# EasyEDA schematic SCH_Extension-Platine-Relais-ESP32-Veth_2025-05-01 (1).json
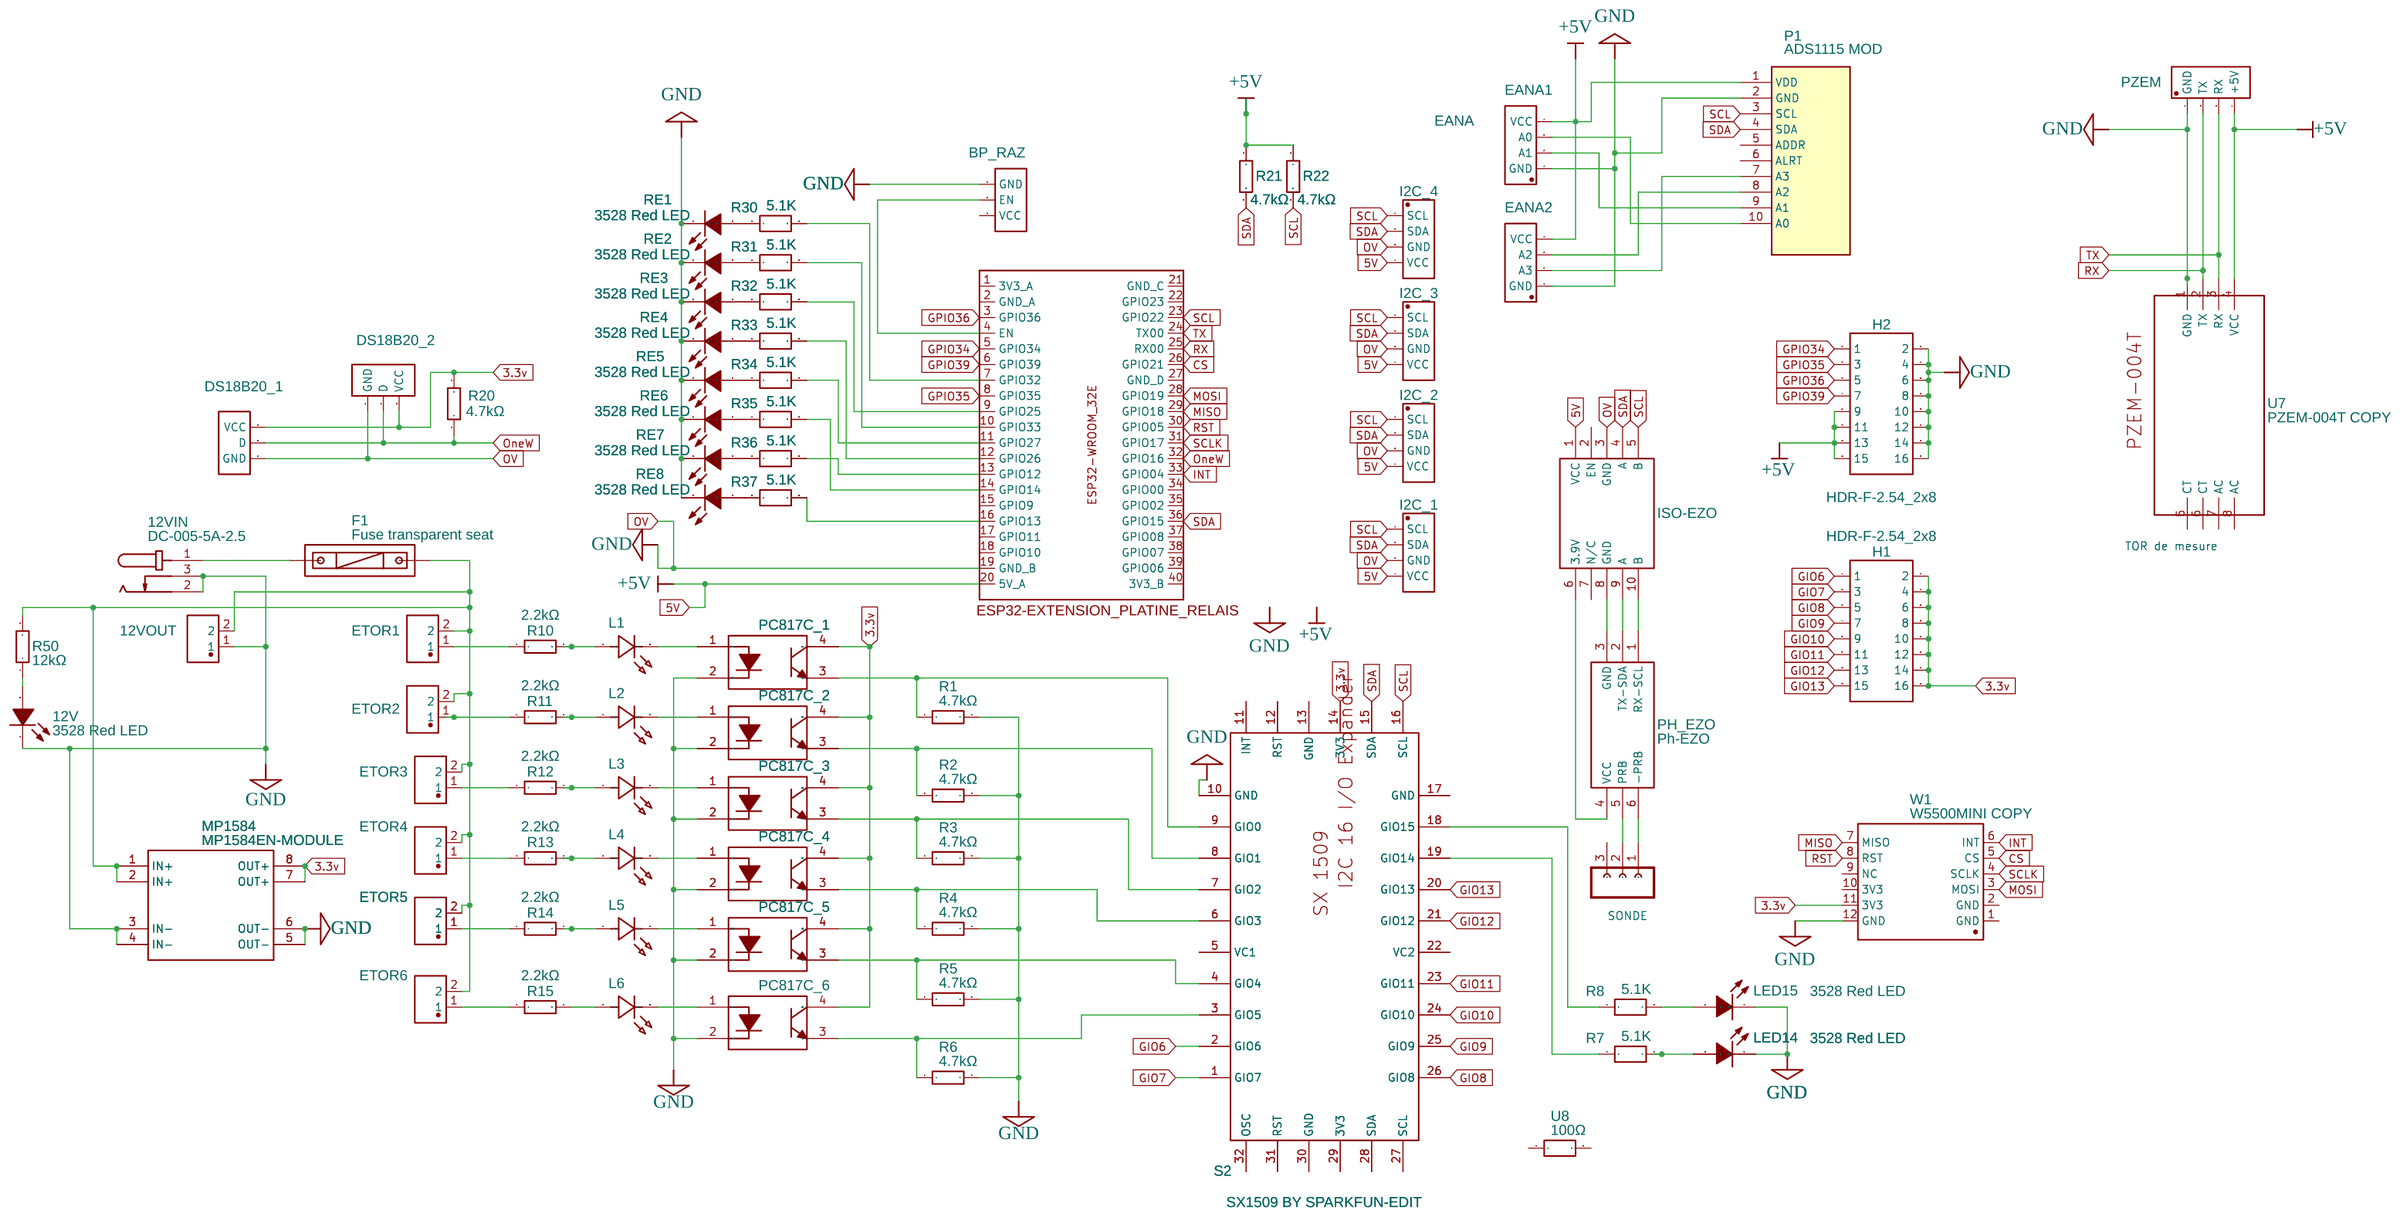
[diagram p0: schematic sheet]

## Parts
12V  3528 Red LED  [LED-SMD_L3.2-W2.8-RD_TJ-S3528UG6W9TLC9Y-A5]
12VIN  DC-005-5A-2.5  [DC-IN-TH_DC-005-5A-2.5]
12VOUT  12V1  [CONN-TH_2P-P5.08_DB128L-5.08-2P]
BP_RAZ  RAZ  [JST-XH-03-PACKAGE-LONG-PAD]
DS18B20_1  DS18B20_1  [JST-XH-03-PACKAGE-LONG-PAD]
DS18B20_2  DS18B20_2  [JST-XH-03-PACKAGE-LONG-PAD]
EANA1  I2C_2  [JST-XH-04-PACKAGE-LONG-PAD]
EANA2  I2C_2  [JST-XH-04-PACKAGE-LONG-PAD]
ETOR1  ETOR1  [CONN-TH_2P-P5.08_DB128L-5.08-2P]
ETOR2  ETOR1  [CONN-TH_2P-P5.08_DB128L-5.08-2P]
ETOR3  ETOR1  [CONN-TH_2P-P5.08_DB128L-5.08-2P]
ETOR4  ETOR1  [CONN-TH_2P-P5.08_DB128L-5.08-2P]
ETOR5  ETOR1  [CONN-TH_2P-P5.08_DB128L-5.08-2P]
ETOR6  ETOR1  [CONN-TH_2P-P5.08_DB128L-5.08-2P]
F1  Fuse transparent seat  [FUSE-TH_L24.5-W9.8-P22.5]
H1  HDR-F-2.54_2x8  [HDR-F-2.54_2X8]
H2  HDR-F-2.54_2x8  [HDR-F-2.54_2X8]
I2C_1  I2C_2  [JST-XH-04-PACKAGE-LONG-PAD]
I2C_2  I2C_2  [JST-XH-04-PACKAGE-LONG-PAD]
I2C_3  I2C_2  [JST-XH-04-PACKAGE-LONG-PAD]
I2C_4  I2C_2  [JST-XH-04-PACKAGE-LONG-PAD]
ISO-EZO  EZO-PH-ISOLATOR  [EZO-PH-ISOLATOR]
L1  HLMP-4700  [LED-TH_BD5.8-P2.54-FD]
L2  HLMP-4700  [LED-TH_BD5.8-P2.54-FD]
L3  HLMP-4700  [LED-TH_BD5.8-P2.54-FD]
L4  HLMP-4700  [LED-TH_BD5.8-P2.54-FD]
L5  HLMP-4700  [LED-TH_BD5.8-P2.54-FD]
L6  HLMP-4700  [LED-TH_BD5.8-P2.54-FD]
LED14  3528 Red LED  [LED-SMD_L3.2-W2.8-RD_TJ-S3528UG6W9TLC9Y-A5]
LED15  3528 Red LED  [LED-SMD_L3.2-W2.8-RD_TJ-S3528UG6W9TLC9Y-A5]
MP1584  MP1584EN-MODULE  [MP1584EN-MODULE]
P1  ADS1115 MOD  [ADS1115MOD]
PH_EZO  Ph-EZO  [EC-EZO]
PZEM  I2C_2  [JST-XH-04-PACKAGE-LONG-PAD]
R1  4.7kΩ  [RES-TH_BD1.9-L3.3-P7.30-D0.5]
R2  4.7kΩ  [RES-TH_BD1.9-L3.3-P7.30-D0.5]
R3  4.7kΩ  [RES-TH_BD1.9-L3.3-P7.30-D0.5]
R4  4.7kΩ  [RES-TH_BD1.9-L3.3-P7.30-D0.5]
R5  4.7kΩ  [RES-TH_BD1.9-L3.3-P7.30-D0.5]
R6  4.7kΩ  [RES-TH_BD1.9-L3.3-P7.30-D0.5]
R7  5.1K  [R1206]
R8  5.1K  [R1206]
R10  2.2kΩ  [RES-TH_BD1.7-L3.5-P7.50-D0.5]
R11  2.2kΩ  [RES-TH_BD1.7-L3.5-P7.50-D0.5]
R12  2.2kΩ  [RES-TH_BD1.7-L3.5-P7.50-D0.5]
R13  2.2kΩ  [RES-TH_BD1.7-L3.5-P7.50-D0.5]
R14  2.2kΩ  [RES-TH_BD1.7-L3.5-P7.50-D0.5]
R15  2.2kΩ  [RES-TH_BD1.7-L3.5-P7.50-D0.5]
R20  4.7kΩ  [RES-TH_BD1.9-L3.3-P7.30-D0.5]
R21  4.7kΩ  [RES-TH_BD1.9-L3.3-P7.30-D0.5]
R22  4.7kΩ  [RES-TH_BD1.9-L3.3-P7.30-D0.5]
R30  5.1K  [R1206]
R31  5.1K  [R1206]
R32  5.1K  [R1206]
R33  5.1K  [R1206]
R34  5.1K  [R1206]
R35  5.1K  [R1206]
R36  5.1K  [R1206]
R37  5.1K  [R1206]
R50  12kΩ  [RES-TH_BD1.7-L3.5-P7.50-D0.5]
RE1  3528 Red LED  [LED-SMD_L3.2-W2.8-RD_TJ-S3528UG6W9TLC9Y-A5]
RE2  3528 Red LED  [LED-SMD_L3.2-W2.8-RD_TJ-S3528UG6W9TLC9Y-A5]
RE3  3528 Red LED  [LED-SMD_L3.2-W2.8-RD_TJ-S3528UG6W9TLC9Y-A5]
RE4  3528 Red LED  [LED-SMD_L3.2-W2.8-RD_TJ-S3528UG6W9TLC9Y-A5]
RE5  3528 Red LED  [LED-SMD_L3.2-W2.8-RD_TJ-S3528UG6W9TLC9Y-A5]
RE6  3528 Red LED  [LED-SMD_L3.2-W2.8-RD_TJ-S3528UG6W9TLC9Y-A5]
RE7  3528 Red LED  [LED-SMD_L3.2-W2.8-RD_TJ-S3528UG6W9TLC9Y-A5]
RE8  3528 Red LED  [LED-SMD_L3.2-W2.8-RD_TJ-S3528UG6W9TLC9Y-A5]
S2  SX1509 BY SPARKFUN-EDIT  [SPARKFUN SX1509-EDIT]
SONDE  FE03-1"  [FE03-1]
U1  PC817C_1  [DIP-4_L6.5-W4.6-P2.54-LS7.6-BL]
U2  PC817C_2  [DIP-4_L6.5-W4.6-P2.54-LS7.6-BL]
U3  PC817C_3  [DIP-4_L6.5-W4.6-P2.54-LS7.6-BL]
U4  PC817C_4  [DIP-4_L6.5-W4.6-P2.54-LS7.6-BL]
U5  PC817C_5  [DIP-4_L6.5-W4.6-P2.54-LS7.6-BL]
U6  PC817C_6  [DIP-4_L6.5-W4.6-P2.54-LS7.6-BL]
U7  PZEM-004T COPY  [PZEM-004T]
U8  100Ω  [R1812]
U$1  ESP32-PLATINE_RELAIS  [ESP32-EXTENSION_PLATINE_RELAIS]
W1  W5500MINI COPY  [W5500]

## Library data of the parts
12V LED14 LED15 RE1-RE8 = 3528 Red LED: Supplier: LCSC; Manufacturer: null; Manufacturer Part: 3528R (SMT业务专用); Supplier Part: C2305; JLCPCB Part Class: Extended Part
12VIN = DC-005-5A-2.5: Contributor: LCSC; Supplier: LCSC; Supplier Part: C381115; Manufacturer: XKB Connectivity(中国星坤); JLCPCB Part Class: Extended Part
12VOUT ETOR1-ETOR6 = DB128L-5.08-2P: Contributor: LCSC; Supplier: LCSC; Supplier Part: C395868; Manufacturer: DORABO(地博电气); Manufacturer Part: DB128L-5.08-2P-GN-S; JLCPCB Part Class: Extended Part
BP_RAZ = -: Supplier: LCSC; Manufacturer: BOOMELE; Manufacturer Part: Header2.54mm 1*3P; image: //image.lceda.cn/szlcsc/C49257.jpg; Supplier Part: C49257
DS18B20_1 DS18B20_2 = -: Supplier: LCSC; Manufacturer: BOOMELE; Manufacturer Part: Header2.54mm 1*3P; image: //image.lceda.cn/szlcsc/C49257.jpg; Supplier Part: C49257; Package Display: No
EANA1 EANA2 I2C_1-I2C_4 PZEM = -: Supplier: LCSC; Manufacturer: Ckmtw; Manufacturer Part: 210S-1*4P L=11.6MMGold-plated black; Contributor: LCSC; Supplier Part: C124378
F1 = Fuse transparent seat: Supplier: LCSC; Manufacturer Part: 保险丝透明座; Manufacturer: xcfuse(旭程); Supplier Part: C58066; JLCPCB Part Class: Extended Part
H1 H2 = HDR-F-2.54_2x8: Supplier Part: C30734; Supplier: LCSC; Contributor: LCEDA_Lib
ISO-EZO = EZO-PH-ISOLATOR: Contributor: Ronak Bera
L1-L6 = HLMP-4700: Contributor: lcsc; Supplier: LCSC; Supplier Part: C2686007; Manufacturer: Broadcom/AVAGO(安华高); JLCPCB Part Class: Extended Part
MP1584 = MP1584EN-MODULE: Contributor: SoulEater
P1 = ADS1115 MOD: sourceId: 1T5FDZYC8
PH_EZO = EC-EZO: Contributor: yns4putra
R1-R6 R20-R22 = MFR0W8F4701A50: Supplier: LCSC; Manufacturer: UNI-ROYAL(厚声); Supplier Part: C58678; JLCPCB Part Class: Extended Part
R7 R8 R30-R37 = R_1206_EU: Contributor: LCEDA_Lib
R10-R15 R50 = MFR0W8F2201A50: Supplier: LCSC; Manufacturer: UNI-ROYAL(厚声); Supplier Part: C58682; JLCPCB Part Class: Extended Part
S2 = SX1509 BY SPARKFUN-EDIT: Manufacturer: SPARkFUN; Manufacturer Part: SX1509; Supplier Part: SX1509; Contributor: NUJAB2S
U1-U6 = PC817C_C5186572: Contributor: lcsc; Supplier: LCSC; Supplier Part: C5186572; Manufacturer: Slkor(萨科微); Manufacturer Part: PC817C; JLCPCB Part Class: Extended Part
U7 = PZEM-004T COPY: Contributor: fernandolopes38
U8 = FRC1812J101 TS: Contributor: lcsc; Supplier: LCSC; Supplier Part: C2933911; Manufacturer: FOJAN(富捷); JLCPCB Part Class: Extended Part
U$1 = -: Package Display: Yes
W1 = W5500MINI: Contributor: acerca_soluciones

## Nets
3.3v: DS18B20_1.3(VCC) DS18B20_2.3(VCC) H1.2 H1.4 H1.6 H1.8 H1.10 H1.12 H1.14 H1.16 MP1584.7(OUT+) MP1584.8(OUT+) R20.1 S2.14(3V3) U1.4(Collector) U2.4(Collector) U3.4(Collector) U4.4(Collector) U5.4(Collector) U6.4(Collector) W1.11(3V3)
+5V: EANA1.4(VCC) EANA2.4(VCC) H2.9 H2.11 H2.13 H2.15 I2C_1.4(VCC) I2C_2.4(VCC) I2C_3.4(VCC) I2C_4.4(VCC) ISO-EZO.1(VCC) P1.1(VDD) PZEM.4(+5V) R21.1 R22.1 U7.4(VCC) U$1.20(5V_A)
GND: 12V.1(K) 12VIN.2 12VIN.3 12VOUT.1 BP_RAZ.1(GND) DS18B20_1.1(GND) DS18B20_2.1(GND) EANA1.1(GND) EANA2.1(GND) H2.2 H2.4 H2.6 H2.8 H2.10 H2.12 H2.14 H2.16 I2C_1.3(GND) I2C_2.3(GND) I2C_3.3(GND) I2C_4.3(GND) ISO-EZO.3(GND) LED14.1(K) LED15.1(K) MP1584.3(IN-) MP1584.4(IN-) MP1584.5(OUT-) MP1584.6(OUT-) P1.2(GND) PZEM.1(GND) R1.2 R2.2 R3.2 R4.2 R5.2 R6.2 RE1.1(K) RE2.1(K) RE3.1(K) RE4.1(K) RE5.1(K) RE6.1(K) RE7.1(K) RE8.1(K) S2.10(GND) U1.2(Cathode) U2.2(Cathode) U3.2(Cathode) U4.2(Cathode) U5.2(Cathode) U6.2(Cathode) U7.1(GND) U$1.19(GND_B) W1.12(GND)
CS: U$1.26(GPIO21) W1.5(CS)
GIO6: H1.1 S2.2(GIO6)
GIO7: H1.3 S2.1(GIO7)
GIO8: H1.5 S2.26(GIO8)
GIO9: H1.7 S2.25(GIO9)
GIO10: H1.9 S2.24(GIO10)
GIO11: H1.11 S2.23(GIO11)
GIO12: H1.13 S2.21(GIO12)
GIO13: H1.15 S2.20(GIO13)
GPIO34: H2.1 U$1.5(GPIO34)
GPIO35: H2.3 U$1.8(GPIO35)
GPIO36: H2.5 U$1.3(GPIO36)
GPIO39: H2.7 U$1.6(GPIO39)
INT: U$1.33(GPIO04) W1.6(INT)
MISO: U$1.29(GPIO18) W1.7(MISO)
MOSI: U$1.28(GPIO19) W1.3(MOSI)
OneW: DS18B20_1.2(D) DS18B20_2.2(D) R20.2 U$1.32(GPIO16)
RST: U$1.30(GPIO05) W1.8(RST)
RX: PZEM.2(TX) U7.2(TX) U$1.25(RX00)
SCL: I2C_1.1(SCL) I2C_2.1(SCL) I2C_3.1(SCL) I2C_4.1(SCL) ISO-EZO.5(B) P1.3(SCL) R22.2 S2.16(SCL) U$1.23(GPIO22)
SCLK: U$1.31(GPIO17) W1.4(SCLK)
SDA: I2C_1.2(SDA) I2C_2.2(SDA) I2C_3.2(SDA) I2C_4.2(SDA) ISO-EZO.4(A) P1.4(SDA) R21.2 S2.15(SDA) U$1.36(GPIO15)
TX: PZEM.3(RX) U7.3(RX) U$1.24(TX00)
Net-(12V-2): 12V.2(A) R50.1
Net-(12VIN-1): 12VIN.1 F1.1
Net-(12VOUT-2): 12VOUT.2 ETOR1.2 ETOR2.2 ETOR3.2 ETOR4.2 ETOR5.2 ETOR6.2 F1.2 MP1584.1(IN+) MP1584.2(IN+) R50.2
Net-(BP_RAZ-2): BP_RAZ.2(EN) U$1.4(EN)
Net-(EANA1-2): EANA1.2(A1) P1.9(A1)
Net-(EANA1-3): EANA1.3(A0) P1.10(A0)
Net-(EANA2-2): EANA2.2(A3) P1.7(A3)
Net-(EANA2-3): EANA2.3(A2) P1.8(A2)
Net-(ETOR1-1): ETOR1.1 R10.1
Net-(ETOR2-1): ETOR2.1 R11.1
Net-(ETOR3-1): ETOR3.1 R12.1
Net-(ETOR4-1): ETOR4.1 R13.1
Net-(ETOR5-1): ETOR5.1 R14.1
Net-(ETOR6-1): ETOR6.1 R15.1
Net-(ISO-EZO-6): ISO-EZO.6(3.9V) PH_EZO.4(VCC)
Net-(ISO-EZO-8): ISO-EZO.8(GND) PH_EZO.3(GND)
Net-(ISO-EZO-9): ISO-EZO.9(A) PH_EZO.2(TX-SDA)
Net-(ISO-EZO-10): ISO-EZO.10(B) PH_EZO.1(RX-SCL)
Net-(L1-1): L1.1(A) R10.2
Net-(L1-2): L1.2(K) U1.1(Anode)
Net-(L2-1): L2.1(A) R11.2
Net-(L2-2): L2.2(K) U2.1(Anode)
Net-(L3-1): L3.1(A) R12.2
Net-(L3-2): L3.2(K) U3.1(Anode)
Net-(L4-1): L4.1(A) R13.2
Net-(L4-2): L4.2(K) U4.1(Anode)
Net-(L5-1): L5.1(A) R14.2
Net-(L5-2): L5.2(K) U5.1(Anode)
Net-(L6-1): L6.1(A) R15.2
Net-(L6-2): L6.2(K) U6.1(Anode)
Net-(LED14-2): LED14.2(A) R7.2
Net-(LED15-2): LED15.2(A) R8.2
Net-(PH_EZO-5): PH_EZO.5(PRB) SONDE.2
Net-(PH_EZO-6): PH_EZO.6(-PRB) SONDE.1
Net-(R1-1): R1.1 S2.9(GIO0) U1.3(Emitter)
Net-(R2-1): R2.1 S2.8(GIO1) U2.3(Emitter)
Net-(R3-1): R3.1 S2.7(GIO2) U3.3(Emitter)
Net-(R4-1): R4.1 S2.6(GIO3) U4.3(Emitter)
Net-(R5-1): R5.1 S2.4(GIO4) U5.3(Emitter)
Net-(R6-1): R6.1 S2.3(GIO5) U6.3(Emitter)
Net-(R7-1): R7.1 S2.19(GIO14)
Net-(R8-1): R8.1 S2.18(GIO15)
Net-(R30-1): R30.1 RE1.2(A)
Net-(R30-2): R30.2 U$1.7(GPIO32)
Net-(R31-1): R31.1 RE2.2(A)
Net-(R31-2): R31.2 U$1.10(GPIO33)
Net-(R32-1): R32.1 RE3.2(A)
Net-(R32-2): R32.2 U$1.9(GPIO25)
Net-(R33-1): R33.1 RE4.2(A)
Net-(R33-2): R33.2 U$1.12(GPIO26)
Net-(R34-1): R34.1 RE5.2(A)
Net-(R34-2): R34.2 U$1.11(GPIO27)
Net-(R35-1): R35.1 RE6.2(A)
Net-(R35-2): R35.2 U$1.14(GPIO14)
Net-(R36-1): R36.1 RE7.2(A)
Net-(R36-2): R36.2 U$1.13(GPIO12)
Net-(R37-1): R37.1 RE8.2(A)
Net-(R37-2): R37.2 U$1.16(GPIO13)

Not connected (* = marked no-connect by the designer): BP_RAZ 3(VCC); ISO-EZO 2(EN) 7(N/C); P1 5(ADDR) 6(ALRT); S2 5(VC1) 11(INT) 12(RST) 13(GND) 17(GND) 22(VC2) 27(SCL) 28(SDA) 29(3V3) 30(GND) 31(RST) 32(OSC); SONDE 3; U7 5(CT) 6(CT) 7(AC) 8(AC); U8 1 2; U$1 1(3V3_A) 2(GND_A) 15(GPIO9) 17(GPIO11) 18(GPIO10) 21(GND_C) 22(GPIO23) 27(GND_D) 34(GPIO00) 35(GPIO02) 37(GPIO08) 38(GPIO07) 39(GPIO06) 40(3V3_B); W1 1(GND) 2(GND) 9(NC) 10(3V3)

## Notes on the sheet
- EANA
- TOR de mesure
